# EAGLE design conv_smd (EAGLE 6.1)
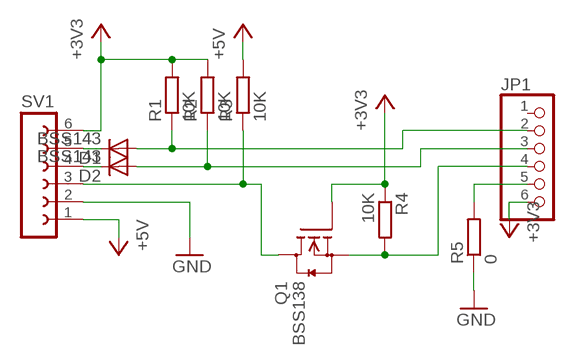
[diagram p0: schematic, sheet 1]

## Parts
D1  BSS143  DIODE-SOD80C  [SOD80C]
D2  BSS143  DIODE-SOD80C  [SOD80C]
JP1  PINHD-1X6/90  [1X06/90]
Q1  BSS138  [SOT23]
R1  10K  R-EU_M0805  [M0805]
R2  10K  R-EU_M0805  [M0805]
R3  10K  R-EU_M1206  [M1206]
R4  10K  R-EU_M0805  [M0805]
R5  0  R-EU_M1206  [M1206]
SV1  FE06W  [FE06W]

## Nets
+3V3: JP1.6 Q1.1(G) R1.2 R2.2 R4.1 SV1.6
+5V: R3.2 SV1.1
GND: R5.1 SV1.2
H-RST: D1.C SV1.5
H-RX: Q1.3(D) R3.1 SV1.3
H-TX: D2.C SV1.4
L-RST: D1.A JP1.2 R1.1
L-RX: JP1.4 Q1.2(S) R4.2
L-TX: D2.A JP1.3 R2.1
N$1: JP1.5 R5.2
Unconnected: JP1.1

## Library data of the parts
D1 D2 = diode:DIODE-: DIODE
JP1 = pinhead:PINHD-1X6: PIN HEADER
Q1 = m-pad-2.1:BSS138: Fairchild Semiconductors BSS138 N-Channel Logic Level Enhancement Mode Field Effect Transistor General Description: These N-Channel enhancement mode field effect transistors are produced using Fairchild's proprietary, high cell density, DMOS technology. These products have been designed to minimize on-state resistance while provide rugged, reliable, and fast switching performance.These products are particularly suited for low voltage, low current applications such as small servo motor control, power MOSFET gate drivers, and other switching applications. Features: 0.22 A, 50 V. RDS(ON) = 3.5Ohm @ VGS = 10 V RDS(ON) = 6.0Ohm @ VGS = 4.5 V High density cell design for extremely low RDS(ON) Rugged and Reliable Compact industry standard SOT-23 surface mount package Please send any comments to: messi@users.sourceforge.net
R1-R5 = rcl:R-EU_: RESISTOR, European symbol
SV1 = con-lsta:FE06W: FEMALE HEADER; OC_FARNELL: unknown; OC_NEWARK: unknown

## Board
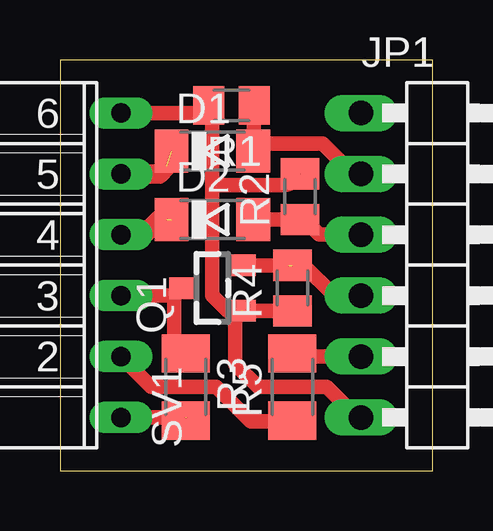
[diagram p1: board, top side]

Size 15.54 x 17.13 mm. Coordinates in mm from the lower left corner, seen from the top.
Outline: 0,0 15.54,0 15.54,17.13 0,17.13 0,0
Copper layers (1*16): Top 0.035mm / dielectric 1.5mm / Bottom 0.035mm
Design rules: minimum track width 10mil, minimum drill 24mil, track to track 8mil, track to pad 8mil, pad to pad 8mil, via to via 8mil, smd to smd 8mil, copper to edge 40mil, drill to drill 8mil, minimum pad ring 10mil, minimum via ring 8mil, stop-mask expansion 4mil, vias tented up to drill 0mil, thermal gap 10mil

### Footprints (pad centres in the part's own frame; a part is rotated, then mirrored left to right if it is on the bottom)
SOD80C = smd 1.4 x 1.8: A 1.7,0; C -1.7,0
1X06/90 = drill 1.016 long: 1 -6.35,-3.81; 2 -3.81,-3.81; 3 -1.27,-3.81; 4 1.27,-3.81; 5 3.81,-3.81; 6 6.35,-3.81
SOT23 = smd 0.9 x 1.2: 1 -0.95,-1.2; 2 0.95,-1.2; 3 0,1.2
M0805 = smd 1.3 x 1.6: 1 -0.95,0; 2 0.95,0
M1206 = smd 1.6 x 2: 1 -1.4,0; 2 1.4,0
FE06W = drill 0.813 long: 1 -6.35,0; 2 -3.81,0; 3 -1.27,0; 4 1.27,0; 5 3.81,0; 6 6.35,0

### Placement (x,y rotation side)
D1  6.35,13.34 0 top
D2  6.35,10.48 0 top
JP1  16.35,8.57 270 top
Q1  6.35,7.62 90 top
R1  7.14,15.24 180 top
R2  10,11.43 90 top
R3  5.24,3.49 270 top
R4  9.68,7.62 90 top
R5  9.68,3.49 90 top
SV1  2.54,8.57 90 top

### Tracks (layer width: path | path; a pad name or v marks a point on that pad's centre or on a via)
+3V3  (2 unrouted)
  Top 0.61: 7.3,6.67 6.99,6.67 6.35,7.3 6.35,14.92 | 7.3,6.67 7.62,6.67 | 7.3,6.67 | 6.35,14.92 SV1.6 | 6.35,14.92 6.35,11.75 6.51,11.91 9.21,11.91 arc62 R2.2 arc-304 10,12.22 | R1.2 6.35,14.92 | 7.3,6.67 7.3,4.45 8.26,3.49 11.11,3.49 12.38,2.22 JP1.6 | R4.1 Q1.1
  Top 0.813: Q1.1
+5V  (1 unrouted)
  Top 0.61: SV1.1 5.24,2.22
  Top 0.813: 5.27,2.22 R3.2
GND
  Top 0.61: SV1.2 3.81,3.49 6.51,3.49 7.94,2.06 9.65,2.06 R5.1
H-RST  (1 unrouted)
  Top 0.813: SV1.5 4.13,12.38 4.45,12.7
H-RX
  Top 0.61: SV1.3 4.76,7.3 | 4.76,7.3 5.08,7.62 Q1.3 | 4.76,7.3 4.76,5.21 R3.1
  Top 0.813: 5.4,5.08 R3.1 5.4,4.76
H-TX  (1 unrouted)
  Top 0.813: SV1.4 3.49,9.84 4.13,10.48 4.45,10.48
L-RST
  Top 0.61: R1.1 D1.A 8.26,13.34 8.26,13.81 8.1,13.97 8.1,13.81 7.94,13.65 10.95,13.65 11.75,12.86 11.75,12.54 11.91,12.38 | 11.91,12.38 11.75,12.38 | JP1.2 11.91,12.38
L-RX  (1 unrouted)
  Top 0.61: Q1.2 9.52,8.57 | 9.52,8.57 9.53,8.57 | 9.52,8.57 10.16,8.57 11.43,7.3 JP1.4
L-TX
  Top 0.61: D2.A R2.1 10.16,10.48 10.79,9.84 JP1.3
N$1
  Top 0.61: R5.2 9.39,4.89 9.53,4.76 JP1.5